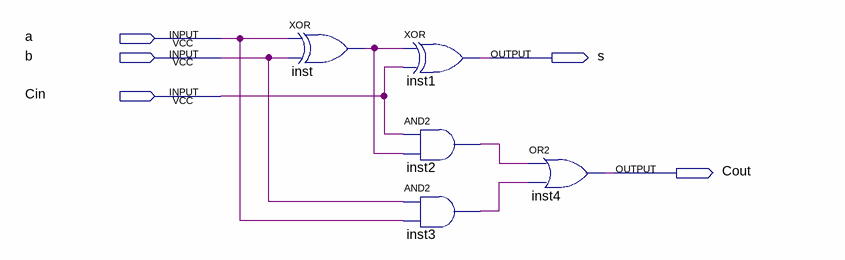
[diagram p0: schematic sheet]
// Quartus schematic FULLADDER.bdf as structural Verilog: 5 symbols, 5 pins
module FULLADDER (
  input  a,
  input  b,
  input  Cin,
  output s,
  output Cout
);

  wire inst2_out, inst3_out, inst_out;

  xor inst (inst_out, a, b);
  xor inst1 (s, inst_out, Cin);
  and inst2 (inst2_out, Cin, inst_out);
  and inst3 (inst3_out, b, a);
  or inst4 (Cout, inst2_out, inst3_out);
endmodule
